# Altium schematic sheet GSB-S04-SensorMicrofit.SchDoc
size A4
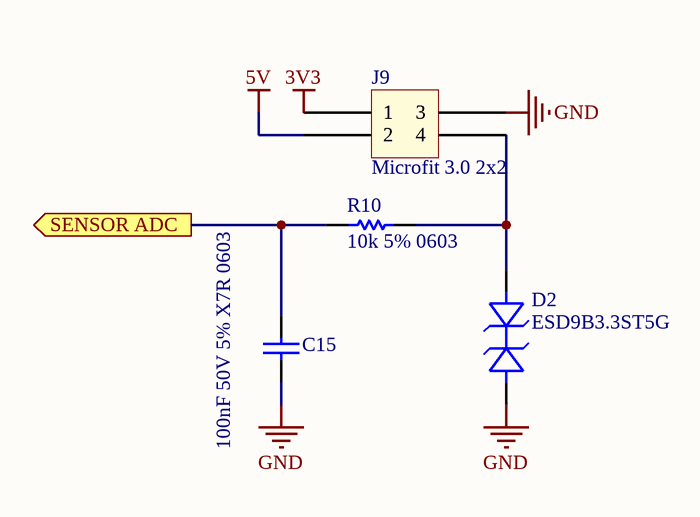
[diagram p0: GSB-S04-SensorMicrofit.SchDoc]

## Parts
C15  100nF 50V 5% X7R 0603  [Cap_Ceramic_0603]
D2  ESD9B3.3ST5G  [SOD-923]
J9  Microfit 3.0 2x2  [Microfit_2X2_R_TH]
R10  10k 5% 0603  [Res_ThinFilm_0603]

## Ports
SENSOR ADC (out)

## Nets
3V3: J9.1
5V: J9.2
GND: C15.1 D2.1 J9.3
SENSOR ADC: C15.2 R10.1 ; port SENSOR ADC
NetD2_2: D2.2 J9.4 R10.2

## Library data of the parts
C15 = 100nF 50V 5% X7R 0603: Capacitor, Ceramic, SMD, 100nF, 50V, 5%, X7R, 0603
D2 = ESD9B3.3ST5G: 11.5V Clamp 2A (8/20µs) Ipp Tvs Diode Surface Mount SOD-923; Manufacturer: ON Semiconductor; MPN: ESD9B3.3ST5G; ComponentLink1Description: Digikey; ComponentLink1URL: https://www.digikey.com.au/product-detail/en/on-semiconductor/ESD9B3.3ST5G/ESD9B3.3ST5GOSCT-ND/2704995; ComponentLink2Description: Datasheet; ComponentLink2URL: https://www.onsemi.cn/pub/Collateral/ESD9B-D.PDF
J9 = Microfit_2x2
R10 = 10k 5% 0603: Resistor, SMD, 10k, 0.1W, 5%, 0603